# EAGLE design IR_module (EAGLE 6.6.0)
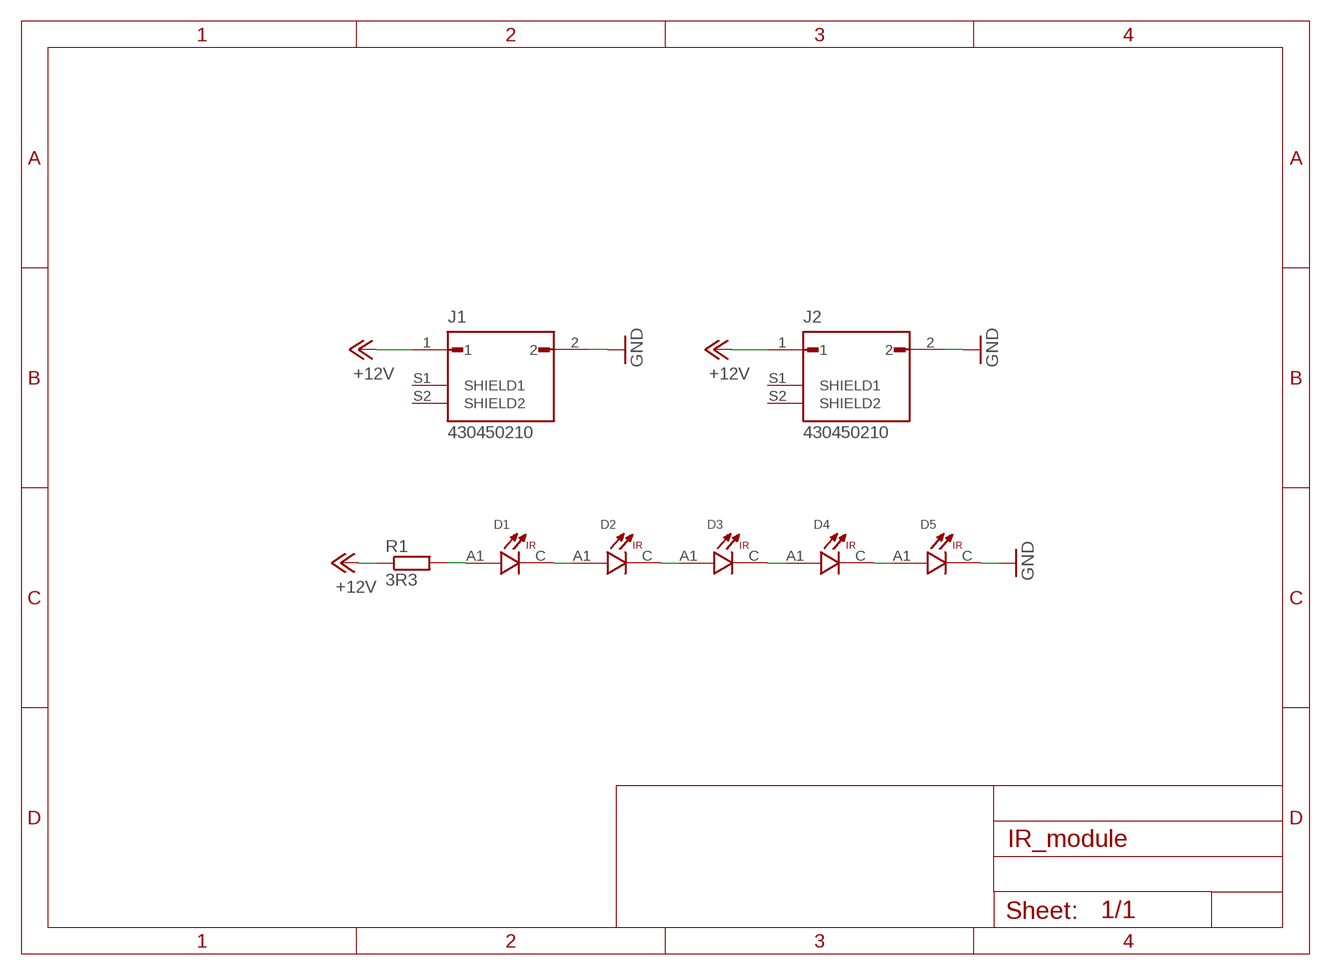
[diagram p0: schematic, sheet 1]

## Parts
D1  SFH4716AS  [LED_SFH4716AS]
D2  SFH4716AS  [LED_SFH4716AS]
D3  SFH4716AS  [LED_SFH4716AS]
D4  SFH4716AS  [LED_SFH4716AS]
D5  SFH4716AS  [LED_SFH4716AS]
J1  430450210  [MOLEX_430450210]
J2  430450210  [MOLEX_430450210]
R1  3R3  R-EU_R2512  [R2512]

## Nets
+12V: J1.1 J2.1 R1.1
GND: D5.C J1.2 J2.2
N$1: D1.C D2.A1(A)
N$2: D2.C D3.A1(A)
N$3: D3.C D4.A1(A)
N$4: D1.A1(A) R1.2
N$5: D4.C D5.A1(A)
Unconnected: J1.S1(SHIELD1) J1.S2(SHIELD2) J2.S1(SHIELD1) J2.S2(SHIELD2)

## Library data of the parts
D1-D5 = OSLON_SFH4716AS:SFH4716AS: Check availability <https://pricing.snapeda.com/parts/SFH%204716AS/OSRAM%20Opto/view-part?ref=eda>; AVAILABILITY: In Stock; CHECK_PRICES: https://www.snapeda.com/parts/SFH%204716AS/OSRAM/view-part/?ref=eda; DESCRIPTION: Infrared (IR) Emitter 860nm 3.2V 1.5A 300mW/sr @ 1A 150° 3-SMD, No Lead; MF: OSRAM Opto; MP: SFH 4716AS; PACKAGE: SMD-3 Osram Opto; PRICE: None; SNAPEDA_LINK: https://www.snapeda.com/parts/SFH%204716AS/OSRAM/view-part/?ref=snap
J1 J2 = Molex_430450210:430450210: Check availability <https://pricing.snapeda.com/parts/43045-0210/Molex/view-part?ref=eda>; AVAILABILITY: In Stock; CHECK_PRICES: https://www.snapeda.com/parts/43045-0210/Molex/view-part/?ref=eda; DESCRIPTION: Microfit 3.0 RA SMT/Nail DR 15Au 2 Ckt | Molex Incorporated 43045-0210; MF: Molex; MP: 43045-0210; PACKAGE: None; PRICE: None; SNAPEDA_LINK: https://www.snapeda.com/parts/43045-0210/Molex/view-part/?ref=snap
R1 = resistor:R-EU_: RESISTOR, European symbol

## Board
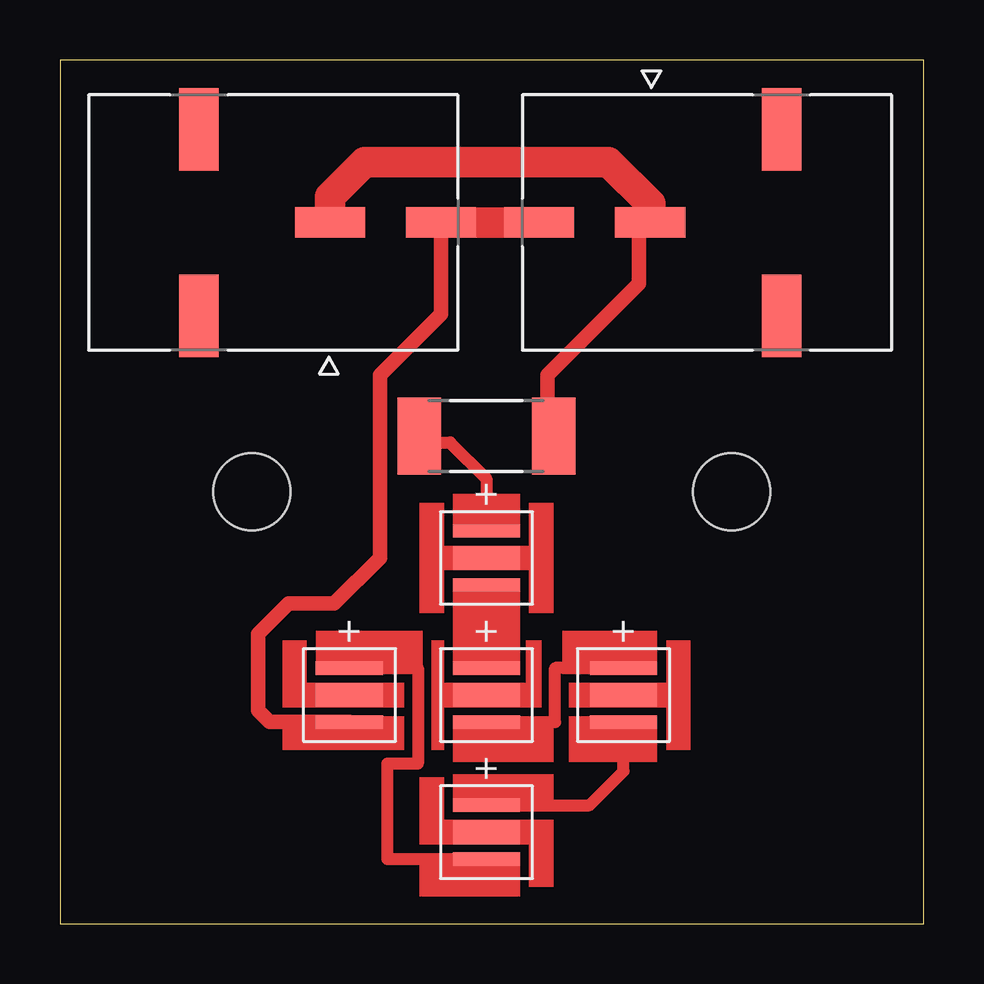
[diagram p1: board, top side]

Size 36 x 36 mm. Coordinates in mm from the lower left corner, seen from the top.
Outline: 0,0 36,0 36,36 0,36 0,0
Copper layers (1*16): Top 0.035mm / dielectric 1.5mm / Bottom 0.035mm
Design rules "default": minimum track width 10mil, minimum drill 24mil, track to track 8mil, track to pad 8mil, pad to pad 8mil, via to via 8mil, smd to smd 8mil, copper to edge 40mil, drill to drill 8mil, minimum pad ring 10mil, minimum via ring 8mil, stop-mask expansion 4mil, vias tented up to drill 0mil, thermal gap 10mil
Holes 3.2 mm at 28,18 8,18

### Footprints (pad centres in the part's own frame; a part is rotated, then mirrored left to right if it is on the bottom)
LED_SFH4716AS = smd 2.8 x 0.55: A1 0,-1.125; C 0,1.125 | smd 2.8 x 1: A2 0,0
MOLEX_430450210 = smd 1.27 x 2.92: 1 0,2.37; 2 0,7 | smd 3.43 x 1.65: S1 3.885,-3.1; S2 -3.885,-3.1
R2512 = smd 1.8 x 3.2: 1 -2.8,0; 2 2.8,0

### Placement (x,y rotation side)
D1  17.78,15.24 180 top
D2  17.78,9.53 180 top
D3  23.5,9.53 180 top
D4  17.78,3.81 180 top
D5  12.06,9.53 180 top
J1  8.89,29.23 270 top
J2  26.98,29.23 90 top
R1  17.78,20.32 180 top

### Tracks (layer width: path | path; a pad name or v marks a point on that pad's centre or on a via)
+12V
  Top 0.508: 20.32,20.58 R1.1
  Top 0.61: R1.1 20.32,20.32 | 20.32,20.58 20.32,22.86 24.13,26.67 24.13,28.75 J2.1
  Top 1.27: J1.1 11.26,30.31 12.7,31.75 22.86,31.75 24.61,30 J2.1
GND
  Top 0.61: J1.2 15.89,25.41 13.34,22.86 13.34,15.24 11.43,13.34 9.53,13.34 8.26,12.06 8.26,8.89 8.74,8.4 D5.C
  Top 1.27: J1.2 J2.2
N$1
  Top 0.508: D1.C D2.A1
N$2
  Top 0.508: D2.C 20.64,8.4 20.64,10.65 D3.A1
N$3
  Top 0.508: D4.A1 22.08,4.93 23.5,6.35 D3.C
N$4
  Top 0.508: 16.66,16.36 D1.A1 17.78,18.54 16.26,20.06 15.24,20.06 R1.2
N$5
  Top 0.508: D4.C 13.65,2.69 13.65,6.67 14.92,6.67 14.92,10.65 D5.A1
(copper drawn outside any net)
  shapes: Top area x22